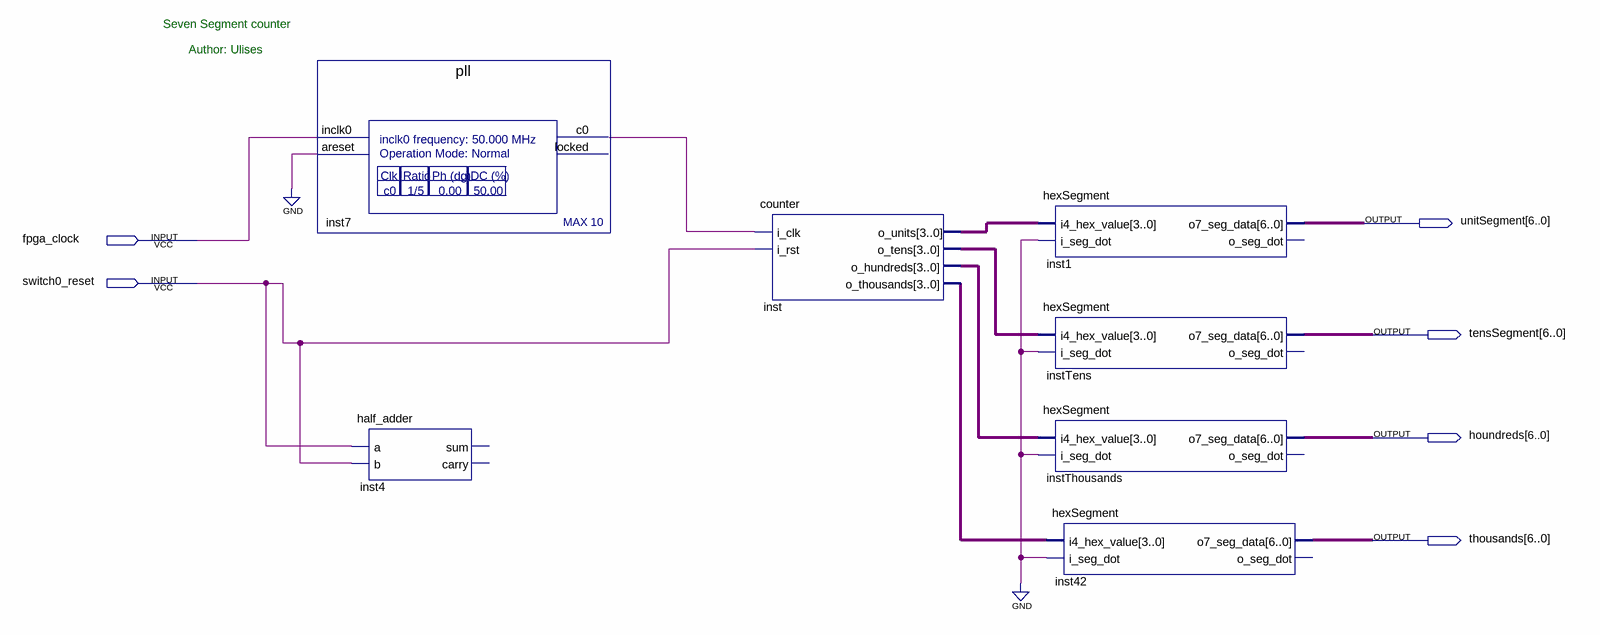
[diagram p0: schematic sheet]
// Quartus schematic segmentCounter_BlockDiagram.bdf as structural Verilog: 7 symbols, 6 pins
module segmentCounter_BlockDiagram (
  input  fpga_clock,
  input  switch0_reset,
  output [6:0] unitSegment,
  output [6:0] tensSegment,
  output [6:0] houndreds,
  output [6:0] thousands
);

  wire inst7_c0;
  wire [3:0] inst_o_hundreds, inst_o_tens, inst_o_thousands, inst_o_units;

  pll inst7 (.inclk0(fpga_clock), .areset(1'b0), .c0(inst7_c0));  // open: locked
  half_adder inst4 (.a(switch0_reset), .b(switch0_reset));  // open: sum, carry
  counter inst (
    .i_clk(inst7_c0), .i_rst(switch0_reset), .o_units(inst_o_units), .o_tens(inst_o_tens),
    .o_hundreds(inst_o_hundreds), .o_thousands(inst_o_thousands));
  hexSegment inst1 (.i4_hex_value(inst_o_units), .i_seg_dot(1'b0), .o7_seg_data(unitSegment));  // open: o_seg_dot
  hexSegment instTens (.i4_hex_value(inst_o_tens), .i_seg_dot(1'b0), .o7_seg_data(tensSegment));  // open: o_seg_dot
  hexSegment instThousands (
    .i4_hex_value(inst_o_hundreds), .i_seg_dot(1'b0), .o7_seg_data(houndreds));  // open: o_seg_dot
  hexSegment inst42 (.i4_hex_value(inst_o_thousands), .i_seg_dot(1'b0), .o7_seg_data(thousands));  // open: o_seg_dot

  // Notes on the sheet:
  //   Seven Segment counter
  //   Author: Ulises
endmodule
